# Altium schematic sheet Main.SchDoc
size C; SheetNumber: 1; SheetTotal: 1
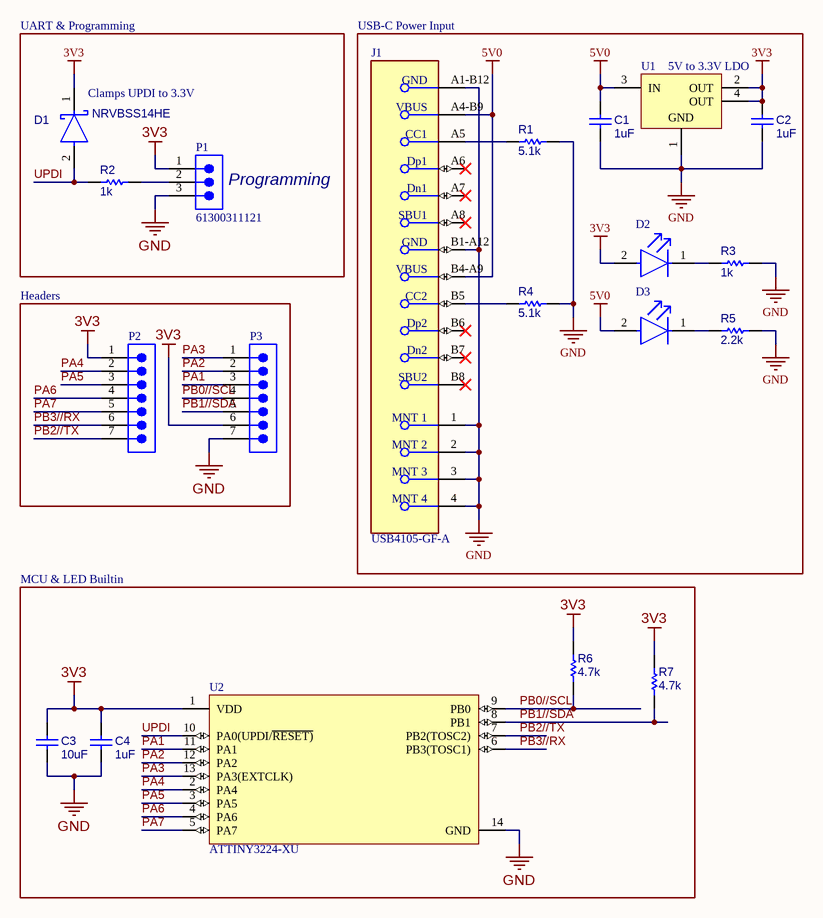
[diagram p0: Main.SchDoc]

## Parts
C1  1uF  [WCAP-CSGP_0603_L1.6W0.8H0.8_Reflow]
C2  1uF  [WCAP-CSGP_0603_L1.6W0.8H0.8_Reflow]
C3  10uF  [WCAP-CSGP_0603_L1.6W0.8H0.8_Reflow]
C4  1uF  [WCAP-CSGP_0603_L1.6W0.8H0.8_Reflow]
D1  NRVBSS14HE  [FP-477AD-MFG]
D2  LTST-C190KGKT  [FP-LTST-C190KGKT-MFG]  (value not drawn)
D3  LTST-C190KGKT  [FP-LTST-C190KGKT-MFG]  (value not drawn)
J1  USB4105-GF-A  [FP-USB4105-GF-A-MFG]
P1  61300311121  [61300311121]
P2  61300711121  [61300711121]  (value not drawn)
P3  61300711121  [61300711121]  (value not drawn)
R1  5.1k  [RESC1608X55X25NL10T15]
R2  1k  [RESC1608X55X25NL10T15]
R3  1k  [RESC1608X55X25NL10T15]
R4  5.1k  [RESC1608X55X25NL10T15]
R5  2.2k  [RESC1608X55X25NL10T15]
R6  4.7k  [RESC1608X55X25NL10T15]
R7  4.7k  [RESC1608X55X25NL10T15]
U1  TLV1117LV33DCYR  [DCY0004A_N]  (value not drawn)
U2  ATTINY3224-XU  [FP-C04-087-ST-MFG]

## Blocks framed on the sheet
Programming: D1 P1 R2
Headers: P2 P3
MCU & LED Builtin: C3 C4 R6 R7 U2

## Nets
3V3: C2.2 C3.2 C4.2 D1.1(C) D2.2(A) P1.1 P2.1 P3.6 R6.2 R7.2 U1.2(OUT) U1.4(OUT) U2.1(VDD)
5V0: C1.2 D3.2(A) J1.A4-B9(VBUS) J1.B4-A9(VBUS) U1.3(IN)
GND: C1.1 C2.1 C3.1 C4.1 J1.1(MNT_1) J1.2(MNT_2) J1.3(MNT_3) J1.4(MNT_4) J1.A1-B12(GND) J1.B1-A12(GND) P1.3 P3.7 R1.2 R3.2 R4.2 R5.2 U1.1(GND) U2.14(GND)
PA1: P3.3 U2.11(PA1)
PA2: P3.2 U2.12(PA2)
PA3: P3.1 U2.13(PA3(EXTCLK))
PA4: P2.2 U2.2(PA4)
PA5: P2.3 U2.3(PA5)
PA6: P2.4 U2.4(PA6)
PA7: P2.5 U2.5(PA7)
PB0//SCL: P3.4 R6.1 U2.9(PB0)
PB1//SDA: P3.5 R7.1 U2.8(PB1)
PB2//TX: P2.7 U2.7(PB2(TOSC2))
PB3//RX: P2.6 U2.6(PB3(TOSC1))
UPDI: D1.2(A) R2.2 U2.10(PA0(UPDI/~{RESET)})
NetD2_1: D2.1(C) R3.1
NetD3_1: D3.1(C) R5.1
NetJ1_A5: J1.A5(CC1) R1.1
NetJ1_B5: J1.B5(CC2) R4.1
NetP1_2: P1.2 R2.1

Not connected (* = marked no-connect by the designer): J1 A6(Dp1)* A7(Dn1)* A8(SBU1)* B6(Dp2)* B7(Dn2)* B8(SBU2)*

## Notes on the sheet
- UART & Programming
- USB-C Power Input
- (near D1) Clamps UPDI to 3.3V
- (near U1) 5V to 3.3V LDO

## Library data of the parts
C1-C4 = CMP-207839-000060-3: 10V tolerance
D1 = CMP-00278-93203856-2: NRVBSS14HE Rectifier Diode, Schottky, 1 Phase, 1 Element, 1A, 40V V(RRM), Silicon; Manufacturer Lifecycle Status: ACTIVE; Capacitance: 55pF; Max Forward Surge Current (Ifsm): 25A; Peak Reverse Current: 5µA; Max Junction Temperature (Tj): 150°C; Forward Current: 1A; Min Operating Temperature: -55°C; NexarPartId: 93203856; Reverse Voltage: 40V; Max Operating Temperature: 150°C; RoHS: Compliant; Lifecycle Status: Production; Max Repetitive Reverse Voltage (Vrrm): 40V; Height: 750µm
D2 D3 = CMP-2000-05197-2: LED GREEN CLEAR CHIP SMD; Test Current: 20mA; Power Rating: 75mW; Forward Voltage: 2V; Wavelength: 574nm; Number of LEDs: 1; Reverse Voltage: 5V; Dominant Wavelength: 571nm; Lens Style: Diffused; Luminous Intensity: 35mcd; Forward Current: 30mA; Viewing Angle: 130°; Lens Color: Colorless; Width: 0.8mm; Case Code (Imperial): 0603; Case Code (Metric): 1608; Number of Pins: 2; Radiation Hardening: No; Package Quantity: 1; Lead Free: Lead Free; Lens Transparency: Clear; Depth: 0.8mm; Power Dissipation: 75mW; Mount: Surface Mount; Max Operating Temperature: 85°C; Case/Package: 0603; Height: 0.8mm; Illumination Color: Green; Color: Green; Length: 1.6mm; Packaging: Tape and Reel; Number of Elements: 1; Min Operating Temperature: -55°C
J1 = CMP-245163-000001-1: CONN RCPT USB2.0 TYPEC 5A; Manufacturer: GCT; Voltage Rating: 20V; Is Female: yes; Current Rating: 5/6.25/1.25/0.25A; Number Of Contacts: 16; Conn Orientation: Right Angle; Device Class L1: Connectors; Category: Conn; Lead Free: Yes; RoHS: TRUE; Temperature Range High: +85°C; Digikey Description: CONN RCPT USB2.0 TYPEC 5A; Device Class L3: unset; ComponentLink2Description: Datasheet; Manufacturer Part Number: USB4105-GF-A; Package: 0; Usb Standard: USB 2.0; Device Class L2: USB Connectors; Automotive: No; Temperature Range Low: -40°C; Height: 3.46mm; Temperature: -40°C to +85°C; Contact Material: Gold,Nickel; ComponentLink2URL: https://gct.co/files/drawings/usb4105.pdf; Octopart: https://octopart.com/usb4105-gf-a-gct-106627878
P1 = CMP-1502-01062-4: THT Vertical Pin Header WR-PHD, Pitch 2.54 mm, Single Row, 3 pins; Connector Type: Male Pin; Number of Contacts: 3; Operating Supply Voltage: 250V; Current Rating: 3A; Pitch: 2.54mm; Contact Resistance: 20mΩ; Gender: Male; Height: 8.94mm; Color: Black; Min Operating Temperature: -40°C; Max Operating Temperature: 105°C; Mount: Through Hole; Termination: Solder; Number of Rows: 1; Packaging: Bulk; Number of Pins: 3; Lead Pitch: 2.54mm; RoHS: Compliant; Contact Plating: Gold; Number of Positions: 3; Lead Free: Lead Free; Voltage Rating: 250V; Contact Mating Length: 5.9944mm; Orientation: Vertical; Contact Material: Gold
P2 P3 = CMP-1502-01074-4: THT Vertical Pin Header WR-PHD, Pitch 2.54 mm, Single Row, 7 pins; Number of Positions: 7; Pitch: 2.54mm; Gender: Male; Operating Supply Voltage: 250V; Contact Resistance: 20mΩ; Current Rating: 3A; Connector Type: Male Pin; Contact Mating Length: 5.9944mm; Number of Rows: 1; Packaging: Bulk; Contact Material: Copper; Orientation: Vertical; Color: Black; Mount: Through Hole; Termination: Solder; RoHS: Compliant; Lead Pitch: 2.54mm; Contact Plating: Gold; Number of Pins: 7; Number of Contacts: 7
R1-R7 = CMP-2000-04186-1
U1 = CMP-0395-00503-2: Single Output LDO, 1 A, Fixed 3.3 V Output, 2 to 5.5 V Input, 4-pin SOT-223 (DCY), -40 to 125 degC, Green (RoHS & no Sb/Br); Manufacturer: Texas Instruments; Vout Adj(Min)(V): 3.3; Vdo(Typ)(mV): 1200; Iq(Typ)(mA): 0.05; Accuracy(%): 2; Iout(Max)(A): 1; SubFamily: Single Channel LDO; Vin(Max)(V): 5.5; PackageReference: DCY0004A; PackageDescription: 4-Pin Plastic Small Outline, Body 3.5 x 6.5 mm, Pitch 2.3 mm; Vout Adj(Max)(V): 3.3; Mounting Technology: Surface Mount; ComponentLink2Description: Datasheet; ComponentLink1Description: Manufacturer URL; PartNumber: TLV1117LV33DCYR; ComponentLink3Description: Package Specification; ComponentLink1URL: http://www.ti.com/; ComponentLink2URL: http://www.ti.com/general/docs/lit/getliterature.tsp?genericPartNumber=TLV1117LV33&fileType=pdf; Fixed Output Options(V): 3.3; PackageVersion: 4202506/B; Vin(Min)(V): 2; DatasheetVersion: SBVS160A; Eco-Plan: Green (RoHS & no Sb/Br); ComponentLink3URL: http://www.ti.com/litv/pdf/mpds094a; Code_JEDEC: TO-261
U2 = CMP-00252-122240563-1: ATTINY3224-XU Microcontroller 8-Bit AVR RISC 32KB Flash 1.8V to 5.5V 14-Pin TSSOP Tube; NexarPartId: 122240563